# Altium schematic sheet Ejection_SCH.SchDoc
size A; SheetNumber: 7; SheetTotal: 9
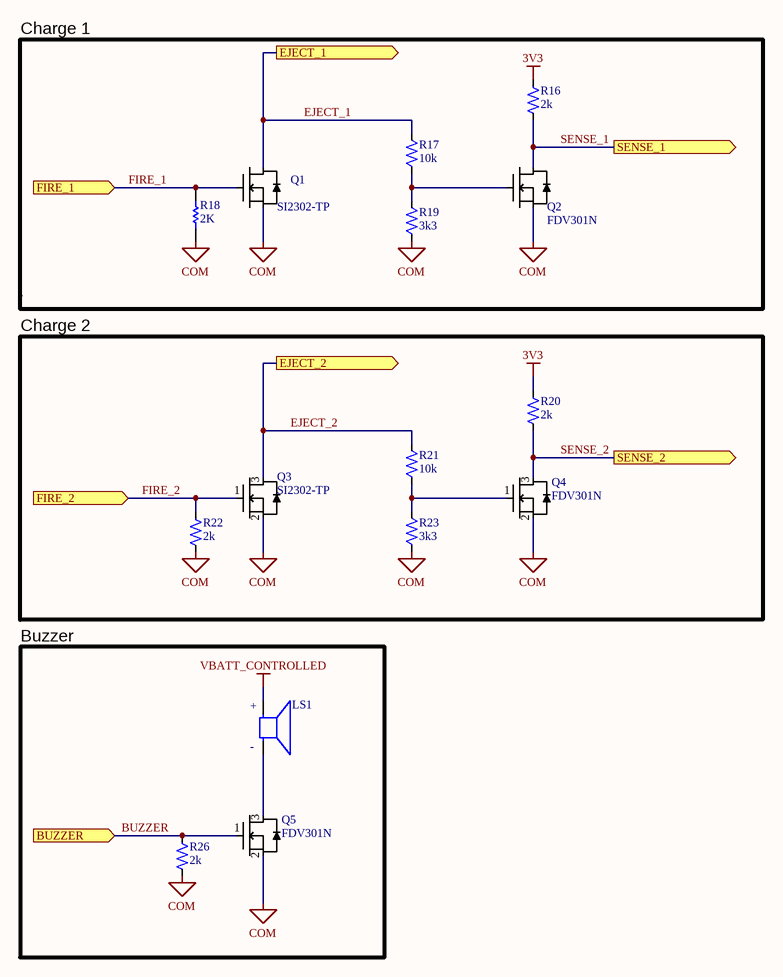
[diagram p0: Ejection_SCH.SchDoc]

## Parts
LS1  AT-1224-TWT-12V-2-R  [XDCR_AT-1224-TWT-12V-2-R]  (value not drawn)
Q1  SI2302-TP  [SOT-23-3]
Q2  FDV301N  [SOT-23-3]
Q3  SI2302-TP  [SOT-23-3]
Q4  FDV301N  [SOT-23-3]
Q5  FDV301N  [SOT-23-3]
R16  Resistance (Ohms): 2k  [R0603]  (hidden comment: ERJ-3GEYJ202V)
R17  Resistance (Ohms): 10k  [R0603]  (hidden comment: ERJ-3GEYJ103V)
R18  2K  [RESC1608X55X30LL15T15]
R19  Resistance (Ohms): 3k3  [R0603]  (hidden comment: ERJ-3EKF3301V)
R20  Resistance (Ohms): 2k  [R0603]  (hidden comment: ERJ-3GEYJ202V)
R21  Resistance (Ohms): 10k  [R0603]  (hidden comment: ERJ-3GEYJ103V)
R22  Resistance (Ohms): 2k  [R0603]  (hidden comment: ERJ-3GEYJ202V)
R23  Resistance (Ohms): 3k3  [R0603]  (hidden comment: ERJ-3EKF3301V)
R26  Resistance (Ohms): 2k  [R0603]  (hidden comment: ERJ-3GEYJ202V)

## Blocks framed on the sheet
Charge 1: Q1 Q2 R16-R19
Charge 2: Q3 Q4 R20-R23
Buzzer: LS1 Q5 R26

## Ports
BUZZER (in), EJECT_1 (out), EJECT_2 (out), FIRE_1 (in), FIRE_2 (in), SENSE_1 (out), SENSE_2 (out)

## Nets
3V3: R16.1 R20.1
COM: Q1.2(S) Q2.2(S) Q3.2(S) Q4.2(S) Q5.2(S) R18.1 R19.1 R22.2 R23.1 R26.2
VBATT_CONTROLLED: LS1.P
BUZZER: Q5.1(G) R26.1 ; port BUZZER
EJECT_1: Q1.3(D) R17.2 ; port EJECT_1
EJECT_2: Q3.3(D) R21.2 ; port EJECT_2
FIRE_1: Q1.1(G) R18.2 ; port FIRE_1
FIRE_2: Q3.1(G) R22.1 ; port FIRE_2
SENSE_1: Q2.3(D) R16.2 ; port SENSE_1
SENSE_2: Q4.3(D) R20.2 ; port SENSE_2
NetLS1_N: LS1.N Q5.3(D)
NetQ2_1: Q2.1(G) R17.1 R19.2
NetQ4_1: Q4.1(G) R21.1 R23.2

## Notes on the sheet
- (near Q3) Trouver une plus petite mossfet
- (in symbol AT-1224-TWT-12V-2-R) +; -

## Library data of the parts
LS1 = AT-1224-TWT-12V-2-R: AUDIO TRANSDUCER 12 VP-P 85 DB 2400 HZ; MF: PUI Audio,; Package: PUI Audio,; MP: AT-1224-TWT-12V-2-R; Purchase-URL: https://pricing.snapeda.com/search/part/AT-1224-TWT-12V-2-R/?ref=eda; SnapEDA_Link: https://www.snapeda.com/parts/AT-1224-TWT-12V-2-R/PUI%20Audio,%20Inc./view-part/3215877/?ref=snap; Check_prices: https://www.snapeda.com/parts/AT-1224-TWT-12V-2-R/PUI%20Audio,%20Inc./view-part/3215877/?ref=eda; Price: None; Value: *; Availability: In Stock
Q1 Q3 = FDV301N: MOSFET N-CH 20V 3A SOT-23; Manufacturer: Fairchild Semiconductor; FET Type: MOSFET N-Channel, Metal Oxide; FET Feature: Logic Level Gate; Drain to Source Voltage (Vdss): 25V; Current - Continuous Drain (Id) @ 25°C: 220mA (Ta); Rds On (Max) @ Id, Vgs: 4 Ohm @ 400mA, 4.5V; Vgs(th) (Max) @ Id: 1.06V @ 250µA; Gate Charge (Qg) @ Vgs: 0.7nC @ 4.5V; Input Capacitance (Ciss) @ Vds: 9.5pF @ 10V; Power - Max: 350mW; ComponentLink1Description: Datasheet; ComponentLink1URL: https://www.fairchildsemi.com/datasheets/FD/FDV301N.pdf; ComponentLink2URL: http://media.digikey.com/Renders/~~Pkg.Case%20or%20Series/SOT-23-3%20PKG.jpg; ComponentLink2Description: Photo; Pricing 1: 1=0.31 (CAN); Supplier 1: Digi-Key; Supplier Part Number 1: FDV301NCT-ND
Q2 Q4 Q5 = FDV301N: MOSFET N-CH 25V 220MA SOT-23; Manufacturer: Fairchild Semiconductor; FET Type: MOSFET N-Channel, Metal Oxide; FET Feature: Logic Level Gate; Current - Continuous Drain (Id) @ 25°C: 220mA (Ta); Rds On (Max) @ Id, Vgs: 4 Ohm @ 400mA, 4.5V; Vgs(th) (Max) @ Id: 1.06V @ 250µA; Gate Charge (Qg) @ Vgs: 0.7nC @ 4.5V; Input Capacitance (Ciss) @ Vds: 9.5pF @ 10V; Power - Max: 350mW; ComponentLink1Description: Datasheet; ComponentLink1URL: https://www.fairchildsemi.com/datasheets/FD/FDV301N.pdf; ComponentLink2URL: http://media.digikey.com/Renders/~~Pkg.Case%20or%20Series/SOT-23-3%20PKG.jpg; ComponentLink2Description: Photo; Pricing 1: 1=0.31 (CAN); Drain to Source Voltage (Vdss): 25V; Supplier 1: Digi-Key; Supplier Part Number 1: FDV301NCT-ND
R16 R20 R22 R26 = ERJ-3GEYJ202V: RES SMD 2K OHM 5% 1/10W 0603; Temperature Coefficient: ±200ppm/°C; Power (Watts): 0.1W, 1/10W; ComponentLink1Description: Datasheet; ComponentLink1URL: http://industrial.panasonic.com/www-cgi/jvcr13pz.cgi?E+PZ+3+AOA0001+ERJ3GEYJ223V+7+WW; ComponentLink2URL: http://media.digikey.com/photos/Panasonic%20Photos/10-0603%20Resistor.jpg; ComponentLink2Description: Photo; Tolerance: ±5%; Composition: Thick Film; Operating Temperature: -55°C ~ 155°C; Supplier 1: Digi-Key; Supplier Part Number 1: P2.0KGCT-ND
R17 R21 = ERJ-3GEYJ103V: RES SMD 10K OHM 5% 1/10W 0603; Temperature Coefficient: ±200ppm/°C; Power (Watts): 0.1W, 1/10W; ComponentLink1Description: Datasheet; ComponentLink1URL: http://industrial.panasonic.com/www-cgi/jvcr13pz.cgi?E+PZ+3+AOA0001+ERJ3GEYJ223V+7+WW; ComponentLink2URL: http://media.digikey.com/photos/Panasonic%20Photos/10-0603%20Resistor.jpg; ComponentLink2Description: Photo; Tolerance: ±5%; Composition: Thick Film; Operating Temperature: -55°C ~ 155°C; Supplier 1: Digi-Key; Supplier Part Number 1: P10KGCT-ND
R18 = CMP-2000-00741-1: RES SMD 2K OHM 5% 1/10W 0603; Part Number: ERJ-3GEYJ202V; Manufacturer: Panasonic
R19 R23 = ERJ-3EKF3301V: RES SMD 3.3K OHM 1% 1/10W 0603; Temperature Coefficient: ±100ppm/°C; Power (Watts): 0.1W; ComponentLink1Description: Datasheet; ComponentLink1URL: http://industrial.panasonic.com/www-cgi/jvcr13pz.cgi?E+PZ+3+AOA0002+ERJ3EKF51R1V+7+WW; ComponentLink2URL: http://media.digikey.com/Renders/Panasonic%20Renders/ERJ-1206%20Pkg.jpg; ComponentLink2Description: Photo; Tolerance: ±1%; Composition: Thick Film; Operating Temperature: -55°C ~ 155°C; Supplier 1: Digi-Key; Supplier Part Number 1: P3.30KHCT-ND